# EAGLE design main (EAGLE 5.11)
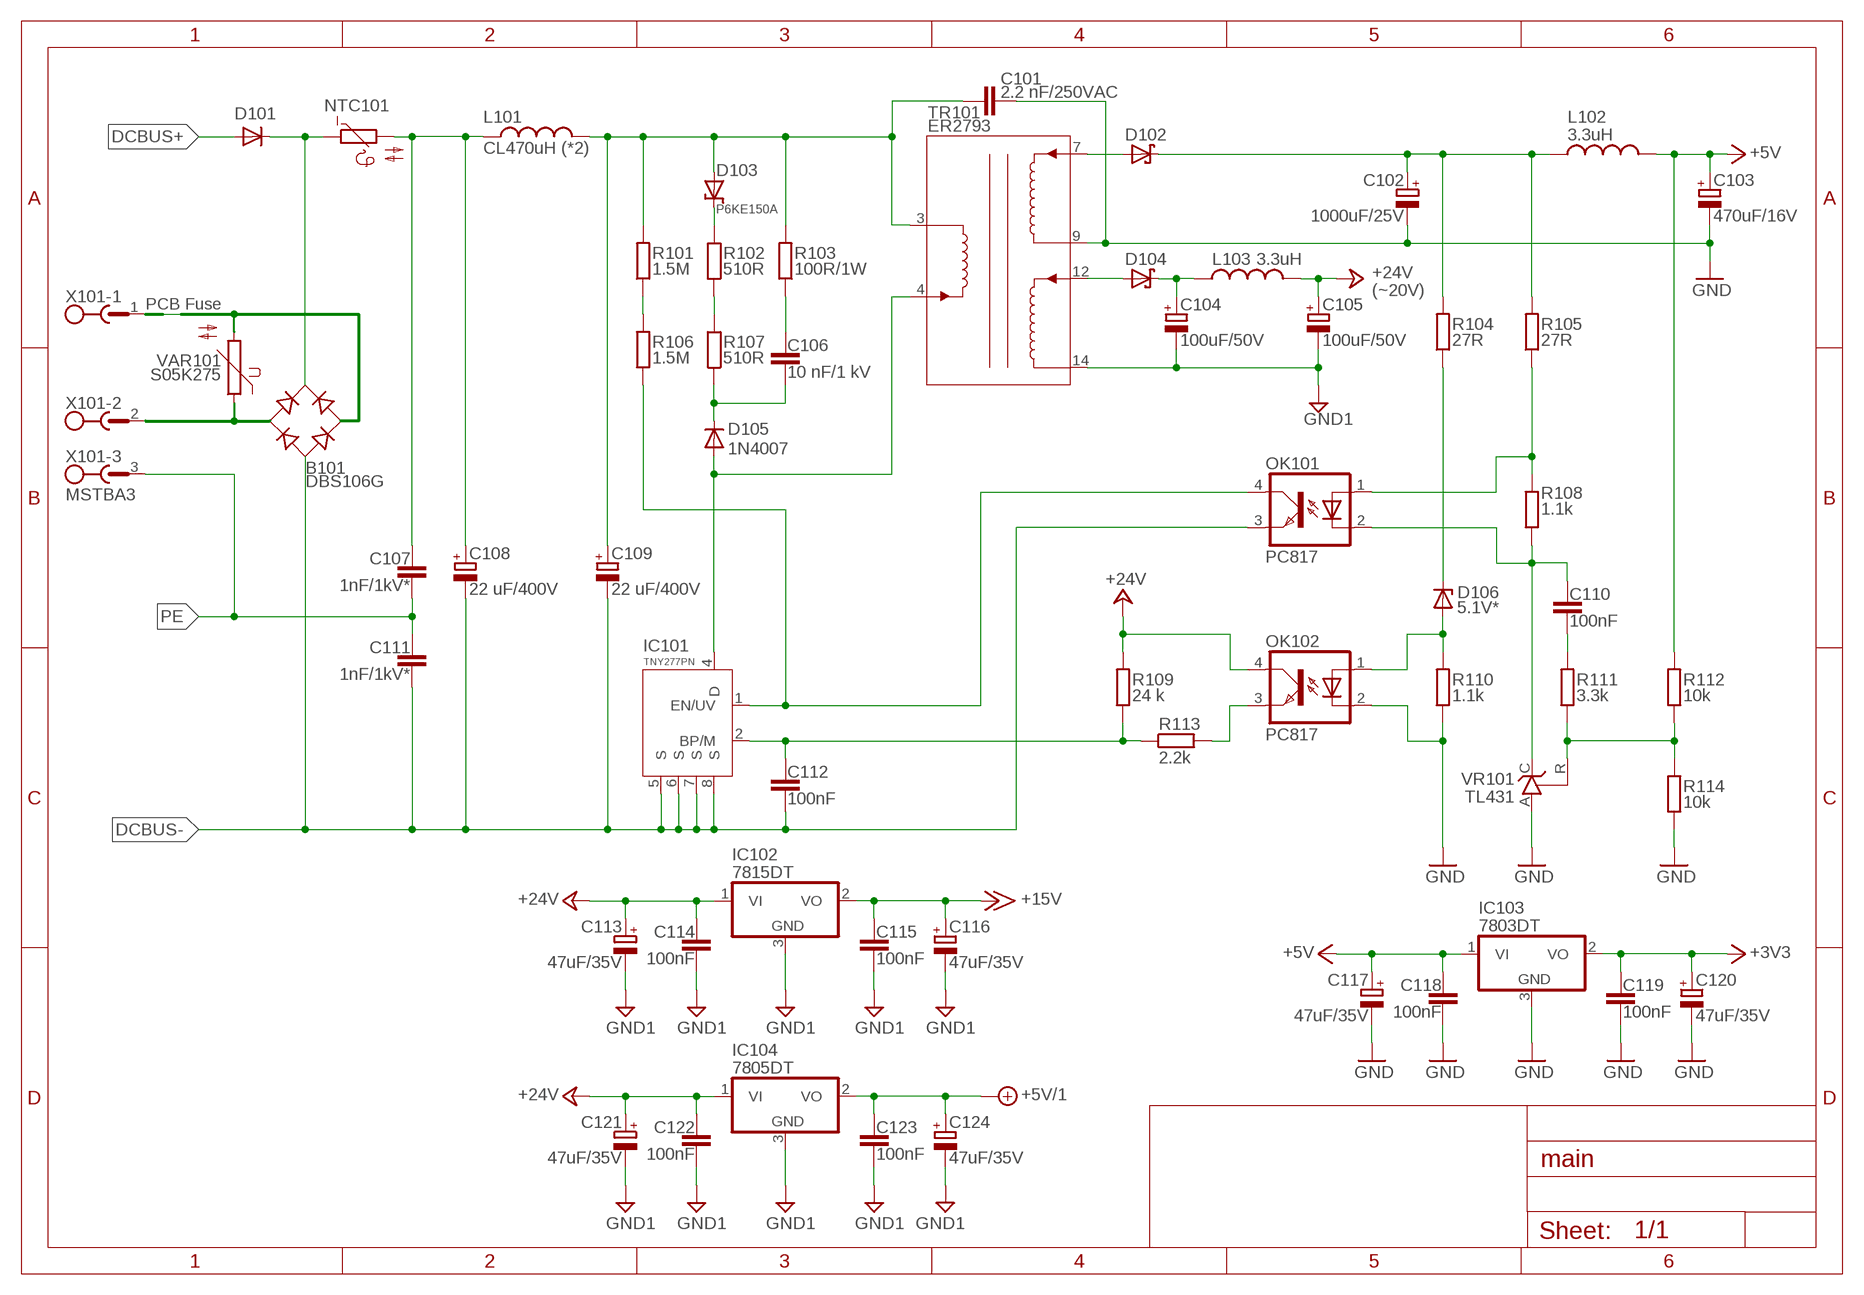
[diagram p0: schematic, sheet 1]

## Parts
B101  DBS106G  [DBS]
C101  2.2 nF/250VAC  C-EU075-032X103  [C075-032X103]
C102  1000uF/25V  CPOL-EUE3.5-10  [E3,5-10]
C103  470uF/16V  CPOL-EUE3.5-8  [E3,5-8]
C104  100uF/50V  CPOL-EUE3.5-8  [E3,5-8]
C105  100uF/50V  CPOL-EUE3.5-8  [E3,5-8]
C106  10 nF/1 kV  C-EU102-043X133  [C102-043X133]
C107  1nF/1kV*  C-EU102-043X133  [C102-043X133]
C108  22 uF/400V  CPOL-EUE5-10.5  [E5-10,5]
C109  22 uF/400V  CPOL-EUE5-10.5  [E5-10,5]
C110  100nF  C-EUC1206  [C1206]
C111  1nF/1kV*  C-EU102-043X133  [C102-043X133]
C112  100nF  C-EUC0603  [C0603]
C113  47uF/35V  CPOL-EUE2.5-6  [E2,5-6]
C114  100nF  C-EUC0805  [C0805]
C115  100nF  C-EUC0805  [C0805]
C116  47uF/35V  CPOL-EUE2.5-6  [E2,5-6]
C117  47uF/35V  CPOL-EUE2.5-6  [E2,5-6]
C118  100nF  C-EUC0805  [C0805]
C119  100nF  C-EUC0805  [C0805]
C120  47uF/35V  CPOL-EUE2.5-6  [E2,5-6]
C121  47uF/35V  CPOL-EUE2.5-6  [E2,5-6]
C122  100nF  C-EUC0805  [C0805]
C123  100nF  C-EUC0805  [C0805]
C124  47uF/35V  CPOL-EUE2.5-6  [E2,5-6]
D101  DIODE-SMB  [SMB]
D102  SCHOTTKY-DIODESMD  [SMB]
D103  P6KE150A  SUPPRESSOR-SMBJ  [SMBJ]
D104  SCHOTTKY-DIODESMD  [SMB]
D105  1N4007  DIODE-DO214AA  [DO214AA]
D106  5.1V*  ZENER-DIODESOD80C  [SOD80C]
IC101  TNY277PN  TNY275-280DIP-8C  [TNY275-DIP-8C]
IC102  7815DT  [TO252]
IC103  7803DT  7805DT  [TO252]
IC104  7805DT  [TO252]
L101  CL470uH (*2)  L-USTFI0307  [TFI0307]
L102  3.3uH  L-US6000-XXX-RC  [6000-XXXX-RC]
L103  3.3uH  L-US6000-XXX-RC  [6000-XXXX-RC]
NTC101  B57164  [B57164]
OK101  PC817  [DIL4-SMD]
OK102  PC817  [DIL4-SMD]
R101  1.5M  R-EU_R1206  [R1206]
R102  510R  R-EU_R1206  [R1206]
R103  100R/1W  R-EU_0414/5V  [0414V]
R104  27R  R-EU_R1206  [R1206]
R105  27R  R-EU_R1206  [R1206]
R106  1.5M  R-EU_R1206  [R1206]
R107  510R  R-EU_R1206  [R1206]
R108  1.1k  R-EU_R1206  [R1206]
R109  24 k  R-EU_R0603  [R0603]
R110  1.1k  R-EU_R1206  [R1206]
R111  3.3k  R-EU_R1206  [R1206]
R112  10k  R-EU_R1206  [R1206]
R113  2.2k  R-EU_R0603  [R0603]
R114  10k  R-EU_R1206  [R1206]
TR101  ER2793  [ER2793]
VAR101  S05K275  [S05K275]
VR101  TL431  TL431CLP  [TO92-CLP]
X101  MSTBA3  [MSTBA3]

## Nets
$235: C101.2 C109.+ D103.A L101.2 R101.2 R103.2 TR101.3
+3V3: C119.1 C120.+ IC103.2(VO)
+5V: C103.+ C117.+ C118.1 IC103.1(VI) L102.2 R112.2
+5V/1: C123.1 C124.+ IC104.2(VO)
+15V: C115.1 C116.+ IC102.2(VO)
+24V: C105.+ C113.+ C114.1 C121.+ C122.1 IC102.1(VI) IC104.1(VI) L103.2 OK102.4(COL) R109.2
DCBUS+: D101.A
DCBUS-: B101.- C108.- C109.- C111.2 C112.2 IC101.5(S) IC101.6(S) IC101.7(S) IC101.8(S) OK101.3(EMIT)
GND: C101.1 C102.- C103.- C117.- C118.2 C119.2 C120.- IC103.3(GND) OK102.2(C) R110.1 R114.1 TR101.9 VR101.A
GND1: C104.- C105.- C113.- C114.2 C115.2 C116.- C121.- C122.2 C123.2 C124.- IC102.3(GND) IC104.3(GND) TR101.14
N$1: D105.A IC101.4(D) TR101.4
N$2: R102.1 R107.2
N$3: C106.2 R103.1
N$4: D103.C R102.2
N$5: C106.1 D105.C R107.1
N$6: D106.A OK102.1(A) R110.2
N$8: C104.+ D104.C L103.1
N$9: IC101.1(EN/UV) OK101.4(COL) R106.1
N$10: B101.AC2 VAR101.2 X101.1
N$11: D104.A TR101.12
N$13: C110.2 R111.2
N$14: D102.A TR101.7
N$15: C110.1 OK101.2(C) R108.1 VR101.C
N$16: C102.+ D102.C L102.1 R104.2 R105.2
N$17: C112.1 IC101.2(BP/M) R109.1 R113.1
N$18: R111.1 R112.1 R114.2 VR101.R
N$19: OK101.1(A) R105.1 R108.2
N$20: OK102.3(EMIT) R113.2
N$22: D106.C R104.1
N$23: B101.AC1 VAR101.1 X101.2
N$39: C107.1 C108.+ L101.1 NTC101.2
N$40: R101.1 R106.2
N$46: B101.+ D101.C NTC101.1
PE: C107.2 C111.1 X101.3

## Notes on the sheet
- (~20V)
- PCB Fuse

## Library data of the parts
B101 = rectifier:DB?*G: Single Phase 1.0 AMP Glass Passivated Bridge Rectifier Taiwan Semiconductor Co.,Ltd. - TSC Source: http://www.taiwansemi.com/TSCbig5/ezcatfiles/cust/img/img/db101g.pdf http://www.ts.com.tw/db/pictures/modules/PDT/PDT060207001/DBLS201G.pdf
C101 C106 C107 C110-C112 C114 C115 C118 C119 C122 C123 = rcl:C-EU: CAPACITOR, European symbol
C102-C105 C108 C109 C113 C116 C117 C120 C121 C124 = rcl:CPOL-EU: POLARIZED CAPACITOR, European symbol
D101 D105 = diode:DIODE-: DIODE
D102 D104 = diode:SCHOTTKY-DIODE: Schottky Diode
D103 = diode:SUPPRESSOR-: Suppressor diode
D106 = diode:ZENER-DIODE: Z-Diode
IC101 = myPowerIntegrations:TNY275-280
IC102-IC104 = linear:78*: Positive VOLTAGE REGULATOR Source: http://cache.national.com/ds/LM/LM78L05.pdf http://www.fairchildsemi.com/ds/LM/LM7805.pdf
L101-L103 = rcl:L-US: INDUCTOR, American symbol
NTC101 = ptc-ntc:B57164: SIEMENS NTC; MPN: B57164K474K52; OC_FARNELL: 9753451; OC_NEWARK: 29M3118
OK101 OK102 = myOptocoupler:PC817
R101-R114 = rcl:R-EU_: RESISTOR, European symbol
TR101 = myPowerIntegrations:ER2793
VAR101 = varistor:S05K275: VARISTOR
VR101 = v-reg:TL431CLP: VOLTAGE REGULATOR
X101 = con-phoenix-508:MSTBA3: PHOENIX; MF: FARNELL; MPN: 1757255; OC_FARNELL: 3705183; OC_NEWARK: 71C4162

## Board
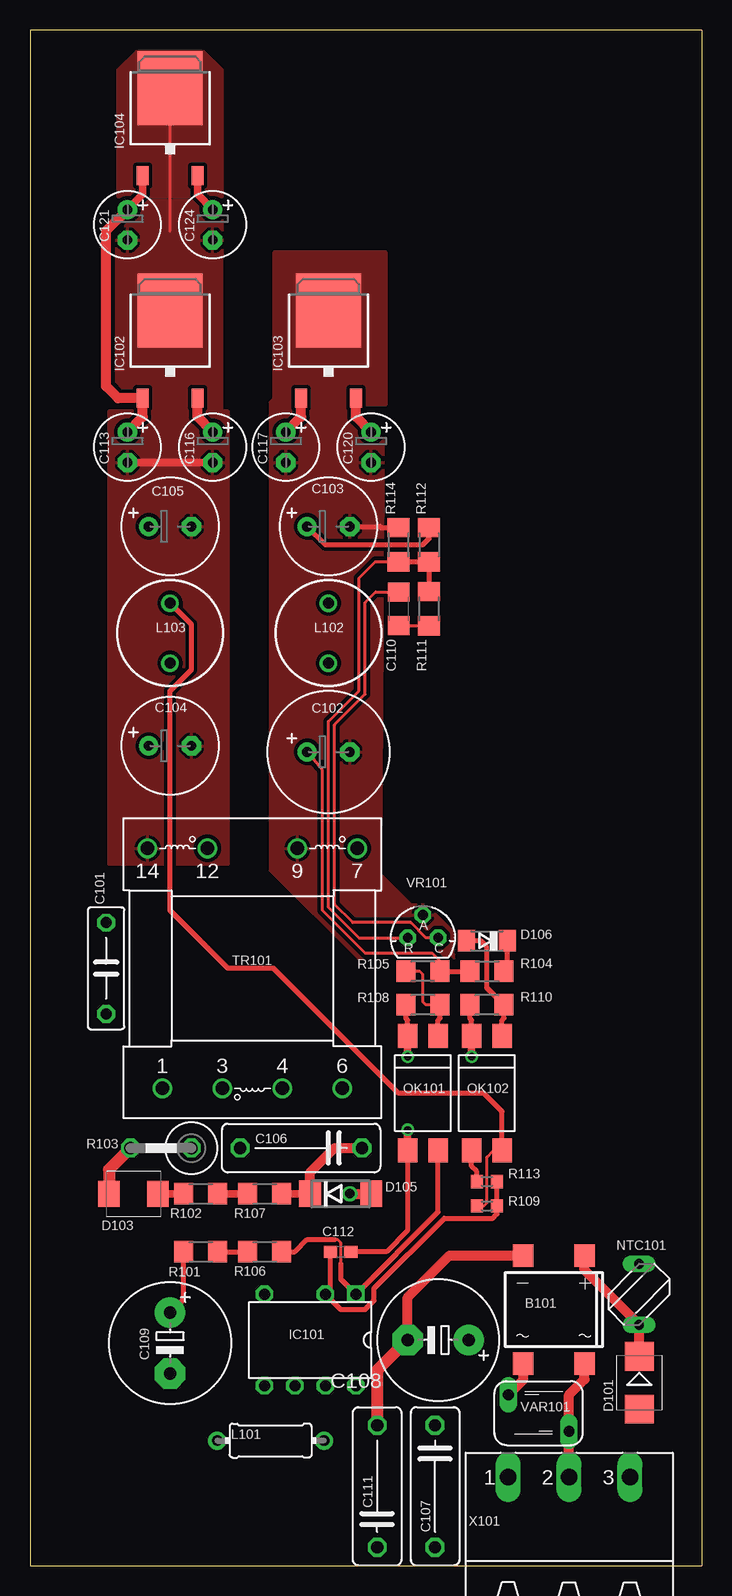
[diagram p1: board, top side]
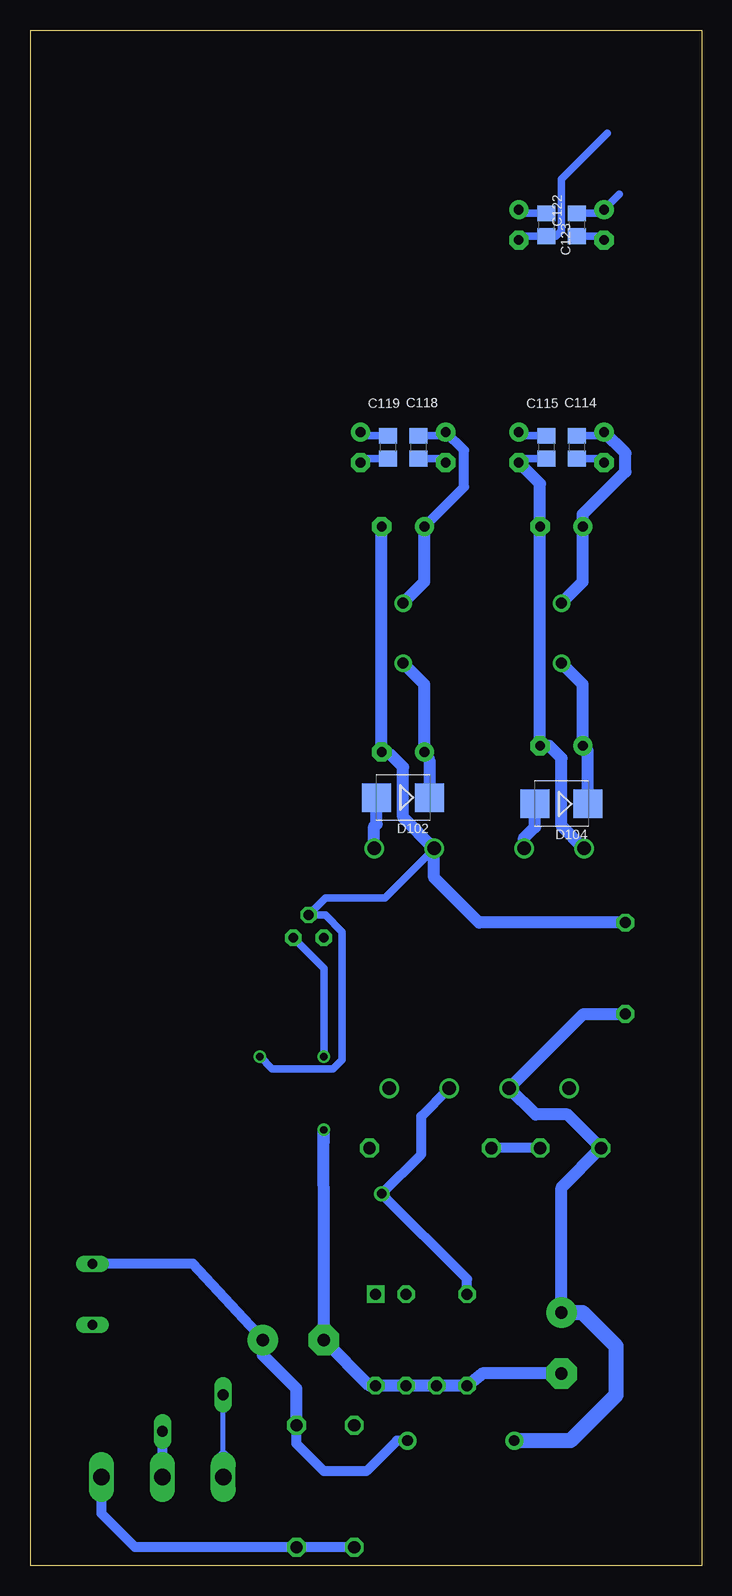
[diagram p2: board, bottom side, seen from below]

Size 56 x 128 mm. Coordinates in mm from the lower left corner, seen from the top.
Outline: 0,128 0,0 56,0 56,128 0,128
Copper layers (1*16): Top 0.075mm / dielectric 1.5mm / Bottom 0.085mm
Design rules "default *": minimum track width 8mil, minimum drill 23mil, track to track 8mil, track to pad 8mil, pad to pad 8mil, via to via 8mil, smd to smd 8mil, copper to edge 25mil, drill to drill 8mil, minimum pad ring 11mil, minimum via ring 9mil, stop-mask expansion 4mil, vias tented up to drill 0mil, thermal gap 10mil

### Footprints (pad centres in the part's own frame; a part is rotated, then mirrored left to right if it is on the bottom)
DBS = smd 1.7 x 1.9: + -2.55,-4.5; - 2.55,-4.5; AC1 -2.55,4.5; AC2 2.55,4.5
C075-032X103 = drill 0.914 octagon: 1 -3.81,0; 2 3.81,0
E3,5-10 = drill 0.813 pad 1.6 round: + -1.778,0 | drill 0.813 pad 1.6 octagon: - 1.778,0
E3,5-8 = drill 0.813 pad 1.6 round: + -1.778,0 | drill 0.813 pad 1.6 octagon: - 1.778,0
C102-043X133 = drill 1.016 octagon: 1 -5.08,0; 2 5.08,0
E5-10,5 = drill 1.016 pad 2.54 round: + -2.54,0 | drill 1.016 pad 2.54 octagon: - 2.54,0
C1206 = smd 1.6 x 1.8: 1 -1.4,0; 2 1.4,0
C0603 = smd 1.1 x 1: 1 -0.85,0; 2 0.85,0
E2,5-6 = drill 0.813 pad 1.6 round: + -1.27,0 | drill 0.813 pad 1.6 octagon: - 1.27,0
C0805 = smd 1.3 x 1.5: 1 -0.95,0; 2 0.95,0
SMB = smd 2.4 x 2.4: A 2.2,0; C -2.2,0
SMBJ = smd 1.78 x 2.16: A 2.04,0; C -2.03,0
DO214AA = smd 1.8 x 2.2: A 2.55,0; C -2.55,0
SOD80C = smd 1.4 x 1.8: A 1.7,0; C -1.7,0
TNY275-DIP-8C = drill 0.9 square: 1 -3.81,-3.81 | drill 0.9 octagon: 2 -1.27,-3.81; 4 3.81,-3.81; 5 3.81,3.81; 6 1.27,3.81; 7 -1.27,3.81; 8 -3.81,3.81
TO252 = smd 1 x 1.6: 1 -2.28,-4.8; 2 2.28,-4.8 | smd 5.4 x 6.2: 3 0,2.5
TFI0307 = drill 0.9 pad 1.5 round: 1 -4.445,0; 2 4.445,0
6000-XXXX-RC = drill 0.9 pad 1.422 round: 1 -2.5,0; 2 2.5,0
B57164 = drill 0.813 long: 1 -2.54,0; 2 2.54,0
DIL4-SMD = smd 1.6 x 2: 1 -1.27,-4.77; 2 1.27,-4.77; 3 1.27,4.77; 4 -1.27,4.77
R1206 = smd 1.6 x 1.803: 1 -1.422,0; 2 1.422,0
0414V = drill 1.016 octagon: 1 -2.54,0; 2 2.54,0
R0603 = smd 1 x 1.1: 1 -0.85,0; 2 0.85,0
ER2793 = drill 1.1 round: 1 -7.5,-10; 3 -2.5,-10; 4 2.5,-10; 6 7.5,-10; 7 8.75,10; 9 3.75,10; 12 -3.75,10; 14 -8.75,10
S05K275 = drill 0.914 long: 1 -1.524,-2.54; 2 1.524,2.54
TO92-CLP = drill 0.813 octagon: A 0,1.905; C 1.27,0; R -1.27,0
MSTBA3 = drill 1.397 long: 1 -5.08,5.08; 2 0,5.08; 3 5.08,5.08

### Placement (x,y rotation side)
B101  43.69,21.34 180 top
C101  6.35,49.78 270 top
C102  24.89,67.82 0 top
C103  24.89,86.61 0 top
C104  11.68,68.33 0 top
C105  11.68,86.61 0 top
C106  22.61,34.8 180 top
C107  33.78,6.6 270 top
C108  34.04,18.8 180 top
C109  11.68,18.54 270 top
C110  30.73,79.76 270 top
C111  28.96,6.6 90 top
C112  25.91,26.16 0 top
C113  8.13,93.22 270 top
C114  10.41,93.22 270 bottom
C115  12.95,93.22 270 bottom
C116  15.24,93.22 270 top
C117  21.34,93.22 270 top
C118  23.62,93.22 270 bottom
C119  26.16,93.22 270 bottom
C120  28.45,93.22 270 top
C121  8.13,111.76 270 top
C122  10.41,111.76 270 bottom
C123  12.95,111.76 270 bottom
C124  15.24,111.76 270 top
D101  50.8,15.24 270 top
D102  24.89,64.01 180 bottom
D103  8.64,30.99 180 top
D104  11.68,63.5 180 bottom
D105  25.91,30.99 0 top
D106  38.1,52.07 180 top
IC101  23.37,18.8 180 top
IC102  11.68,102.11 0 top
IC103  24.89,102.11 0 top
IC104  11.68,120.65 0 top
L101  20.07,10.41 180 top
L102  24.89,77.72 90 top
L103  11.68,77.72 90 top
NTC101  50.8,22.61 90 top
OK101  32.77,39.37 180 top
OK102  38.1,39.37 180 top
R101  14.22,26.16 180 top
R102  14.22,30.99 180 top
R103  10.92,34.8 180 top
R104  38.1,49.53 180 top
R105  32.77,49.53 0 top
R106  19.56,26.16 180 top
R107  19.56,30.99 180 top
R108  32.77,46.74 0 top
R109  38.1,29.97 180 top
R110  38.1,46.74 0 top
R111  33.27,79.76 270 top
R112  33.27,85.09 90 top
R113  38.1,32 180 top
R114  30.73,85.09 270 top
TR101  18.54,49.78 0 top
VAR101  42.42,12.7 90 top
VR101  32.77,52.32 0 top
X101  44.96,2.29 0 top

### Tracks (layer width: path | path; a pad name or v marks a point on that pad's centre or on a via)
$235
  Top 0.406: R101.2 12.8,22.2 C109.+
  Top 1.016: R103.2 6.6,33.01 D103.A
  Bottom 1.016: C101.2 9.85,45.97 TR101.3 13.85,37.59 11.18,37.59 R103.2 11.68,31.5 C109.+
  Bottom 1.27: C109.+ 9.91,21.08 7.11,18.29 7.11,14.22 10.92,10.41 L101.2
+3V3
  Top 0.813: IC103.2 27.17,95.76 C120.+
  Bottom 0.61: C119.1 28.13,94.17 C120.+
+5V
  Top 0.406: R112.2 33.27,85.6 32.77,85.09 24.64,85.09 C103.+
  Top 0.813: IC103.1 22.61,95.76 C117.+
  Bottom 0.61: C118.1 21.66,94.17 C117.+
  Bottom 0.813: C103.+ 19.81,89.92 19.81,92.96 C117.+
  Bottom 1.016: C103.+ 23.11,82 L102.2
+5V/1
  Top 0.61: IC104.2 13.96,114.31 C124.+
  Bottom 0.61: C123.1 14.92,112.71 C124.+
+15V
  Top 0.813: IC102.2 13.96,95.76 C116.+
  Bottom 0.61: C115.1 14.92,94.17 C116.+
+24V
  Top 0.254: R109.2 37.85,29.97 38.1,30.23 38.1,34.04 38.66,34.6 OK102.4
  Top 0.406: L103.2 13.46,78.45 13.46,74.68 11.68,72.9 11.68,54.61 16.51,49.78 20.32,49.78 30.73,39.37 37.85,39.37 39.37,37.85 OK102.4
  Top 0.61: IC104.1 9.4,114.31 C121.+
  Top 0.813: C113.+ 9.4,95.76 IC102.1 7.34,97.31 6.35,98.3 6.35,111.25 C121.+
  Bottom 0.61: C114.1 8.45,94.17 C113.+ | C122.1 8.45,112.71 C121.+ 6.86,114.3
  Bottom 1.016: L103.2 9.91,82 C105.+ 9.91,87.63 6.35,91.19 6.35,92.71 C113.+
DCBUS-  (via drill 0.6)
  Top 0.406: C112.2 29.72,26.16 31.5,27.94 OK101.3
  Top 0.61: v31.5,36.32 OK101.3
  Top 0.813: B101.- 34.98,25.84 31.5,22.35 C108.-
  Top 1.016: C108.- 28.96,16.26 C111.2
  Bottom 0.61: v31.5,36.32 31.5,35.31 31.51,35.3
  Bottom 1.016: C109.- 18.29,16 IC101.5 IC101.6 IC101.7 IC101.8 27.69,14.99 C108.- 31.5,26.92 v31.51,36.31 31.51,35.3
GND  (via drill 0.6)
  Top 0.406: R114.1 29.31,86.51 29.21,86.61 C103.- | R110.1 36.68,45.62 36.83,45.47 OK102.2
  Top 0.61: v36.83,42.42 OK102.2
  Bottom 0.61: v36.83,42.42 35.81,41.4 30.73,41.4 29.97,42.16 29.97,52.83 31.37,54.23 VR101.A 31.37,55.63 26.42,55.63 22.35,59.69 | C118.2 21.66,92.27 C117.- | C119.2 28.13,92.27 C120.-
  Bottom 1.016: C101.1 18.54,53.59 22.29,57.34 TR101.9 24.89,62.38 24.89,66.55 25.91,67.56 C102.- C103.-
  pour Top (isolate 0.305): 20.07,57.91 20.07,97.03 29.46,97.03 29.21,58.42 29.21,57.66 31.75,55.12 33.02,55.12 35.31,52.83 35.31,50.55 27.43,50.55
  pour Top (isolate 0.305, no thermals): 20.07,96.77 29.72,96.77 29.72,109.47 20.32,109.47 20.32,97.28 20.07,97.03
GND1
  Top 0.254: 11.68,111.25 IC104.3
  Top 0.61: C116.- C113.-
  Bottom 0.61: C115.2 14.92,92.27 C116.- | C122.2 8.45,110.81 C121.- | C114.2 8.45,92.27 C113.- | 7.87,119.38 11.68,115.57 11.68,111.25 12.13,110.81 C123.2 14.92,110.81 C124.-
  Bottom 1.016: TR101.14 11.68,61.68 11.68,67.31 12.7,68.33 C104.- C105.- 13.46,90.17 C116.-
  pour Top (isolate 0.305, no thermals): 7.37,114.05 7.37,124.71 8.89,126.24 14.48,126.24 16,124.71 16,114.05
  pour Top (isolate 0.305): 7.37,113.79 16,113.79 16,108.97 7.11,108.97 7.11,113.54
  pour Top (isolate 0.305, no thermals): 7.11,108.97 7.11,96.27 16,96.27 16,108.97
  pour Top (isolate 0.305): 6.6,96.27 16.51,96.27 16.51,58.42 6.6,58.42
N$1  (via drill 0.8)
  Top 0.813: v26.67,30.99 D105.A
  Bottom 0.813: TR101.4 23.37,37.46 23.37,34.29 v26.67,30.99 19.56,23.88 IC101.4
N$2
  Top 0.61: R102.1 R107.2
N$3
  Bottom 0.813: R103.1 C106.2
N$4
  Top 0.61: D103.C R102.2
N$5
  Top 0.61: R107.1 D105.C
  Top 0.813: C106.1 25.4,34.8 23.36,32.76 D105.C
N$6
  Top 0.406: D106.A 37.59,52.07 38.1,51.56 38.1,48.16 R110.2 39.52,45.62 39.37,45.47 OK102.1
N$8
  Bottom 1.016: D104.C 9.48,67.9 C104.+ 9.91,73.45 L103.1
N$9
  Top 0.254: 25.4,27.18 25.65,27.18 25.91,26.92 25.91,25.15
  Top 0.406: 25.91,25.15 25.91,23.88 IC101.1 34.04,29.46 OK101.4 | 25.4,27.18 23.11,27.18 22.1,26.16 R106.1
N$10
  Top 0.813: B101.AC2 41.14,15.48 VAR101.2
  Bottom 0.406: 39.88,9.14 39.88,13.21
  Bottom 1.016: X101.1 39.88,9.14 | 39.88,13.21 VAR101.2
N$11
  Bottom 1.016: TR101.12 14.79,60.65 13.88,61.55 D104.A
N$13
  Top 0.254: C110.2 33.25,78.36 R111.2
N$14
  Bottom 1.016: TR101.7 27.29,61.61 27.09,61.81 D102.A
N$15  (via drill 0.6)
  Top 0.254: VR101.C 33.02,52.32 31.75,53.59 26.92,53.59 25.4,55.12 25.4,70.1 27.94,72.64 27.94,80.26 28.83,81.16 C110.1
  Top 0.406: R108.1 31.34,45.62 31.5,45.47 OK101.2
  Top 0.61: v31.5,42.42 OK101.2
  Top 0.813: R108.1 31.5,46.58 31.5,46.23 31.34,46.38
  Bottom 0.61: VR101.C 31.5,49.78 v31.5,42.42
N$16
  Top 0.254: R105.2 34.19,50.39 33.53,51.05 27.94,51.05 24.38,54.61 24.38,66.29 C102.+
  Top 0.406: R105.2 R104.2
  Bottom 1.016: D102.C 22.69,67.14 C102.+ 23.11,73.45 L102.1
N$17
  Top 0.406: R113.1 R109.1 38.95,29.3 38.61,28.96 34.54,28.96 28.7,23.11 28.7,22.1 27.94,21.34 25.91,21.34 IC101.2 25.06,23.03 C112.1
N$18
  Top 0.254: VR101.R 27.43,52.32 24.89,54.86 24.89,70.36 27.43,72.9 27.43,82.3 28.8,83.67 R114.2
  Top 0.406: R114.2 R112.1 R111.1
N$19
  Top 0.254: R105.1 32.51,49.53 32.77,49.28 32.77,46.99 33.02,46.74 R108.2
  Top 0.406: R108.2 34.19,45.62 34.04,45.47 OK101.1
N$20
  Top 0.406: OK102.3 36.83,33.27 37.25,32.85 R113.2
N$22
  Top 0.406: D106.C 39.8,49.81 R104.1
N$23
  Top 0.813: B101.AC1 46.24,15.5 44.96,14.22 44.96,11.69 44.96,11.68 VAR101.1 X101.2
  Bottom 0.813: X101.2 VAR101.1
N$39
  Bottom 0.813: L101.1 25.4,10.41 27.94,7.87 31.5,7.87 33.78,10.16 C107.1 | NTC101.2 42.42,25.15 C108.+
  Bottom 1.016: C107.1 33.78,14.73 36.58,17.53 C108.+
N$40
  Top 0.406: R101.1 R106.2
N$46
  Top 0.813: B101.+ 46.24,24.63 NTC101.1 D101.C
PE
  Bottom 0.813: C111.1 C107.2 47.24,1.52 50.04,4.32 X101.3